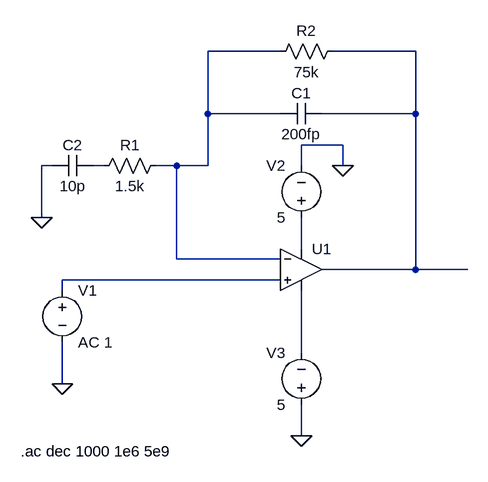
[diagram p0: schematic fast-shaper-v2.asc]
fast-shaper-v2.asc, the LTspice schematic file:
Version 4
SHEET 1 880 680
WIRE 384 -208 272 -208
WIRE 592 -208 464 -208
WIRE 272 -112 272 -208
WIRE 384 -112 272 -112
WIRE 592 -112 592 -208
WIRE 592 -112 448 -112
WIRE 480 -64 416 -64
WIRE 32 -32 16 -32
WIRE 112 -32 96 -32
WIRE 224 -32 192 -32
WIRE 272 -32 272 -112
WIRE 272 -32 224 -32
WIRE 416 -32 416 -64
WIRE 480 -32 480 -64
WIRE 16 48 16 -32
WIRE 416 96 416 48
WIRE 224 112 224 -32
WIRE 384 112 224 112
WIRE 592 128 592 -112
WIRE 592 128 448 128
WIRE 672 128 592 128
WIRE 384 144 48 144
WIRE 48 160 48 144
WIRE 416 256 416 160
WIRE 48 304 48 240
WIRE 416 384 416 336
FLAG 416 384 0
FLAG 480 -32 0
FLAG 48 304 0
FLAG 16 48 0
SYMBOL voltage 48 144 R0
WINDOW 123 0 0 Left 0
WINDOW 39 0 0 Left 0
SYMATTR InstName V1
SYMATTR Value AC 1
SYMBOL res 208 -48 R90
WINDOW 0 0 56 VBottom 2
WINDOW 3 32 56 VTop 2
SYMATTR InstName R1
SYMATTR Value 1.5k
SYMBOL res 480 -224 R90
WINDOW 0 0 56 VBottom 2
WINDOW 3 32 56 VTop 2
SYMATTR InstName R2
SYMATTR Value 75k
SYMBOL voltage 416 64 R180
WINDOW 0 24 96 Left 2
WINDOW 3 24 16 Left 2
WINDOW 123 0 0 Left 0
WINDOW 39 0 0 Left 0
SYMATTR InstName V2
SYMATTR Value 5
SYMBOL voltage 416 352 R180
WINDOW 0 24 96 Left 2
WINDOW 3 24 16 Left 2
WINDOW 123 0 0 Left 0
WINDOW 39 0 0 Left 0
SYMATTR InstName V3
SYMATTR Value 5
SYMBOL OpAmps\\UniversalOpAmp1 416 128 R0
SYMATTR InstName U1
SYMATTR Value2 Avol=1Meg GBW=200Meg Vos=0
SYMBOL cap 448 -128 R90
WINDOW 0 0 32 VBottom 2
WINDOW 3 32 32 VTop 2
SYMATTR InstName C1
SYMATTR Value 200fp
SYMBOL cap 96 -48 R90
WINDOW 0 0 32 VBottom 2
WINDOW 3 32 32 VTop 2
SYMATTR InstName C2
SYMATTR Value 10p
TEXT -16 408 Left 2 !.ac dec 1000 1e6 5e9

The netlist it stands for:
* fast-shaper-v2.asc
V1 N005 0 AC 1
R1 N001 N003 1.5k
R2 N002 N001 75k
V2 N004 0 5
V3 0 N006 5
XU1 N005 N001 N004 N006 N002 level1 Avol=1Meg GBW=200Meg Vos=0 En=0 Enk=0 In=0 Ink=0 Rin=500Meg  ; pins In+ In- V+ V- OUT
C1 N002 N001 200fp
C2 N003 0 10p
.ac dec 1000 1e6 5e9
.lib UniversalOpAmp1.lib
.backanno
.end